# Altium project HEXCORE.PrjPcb
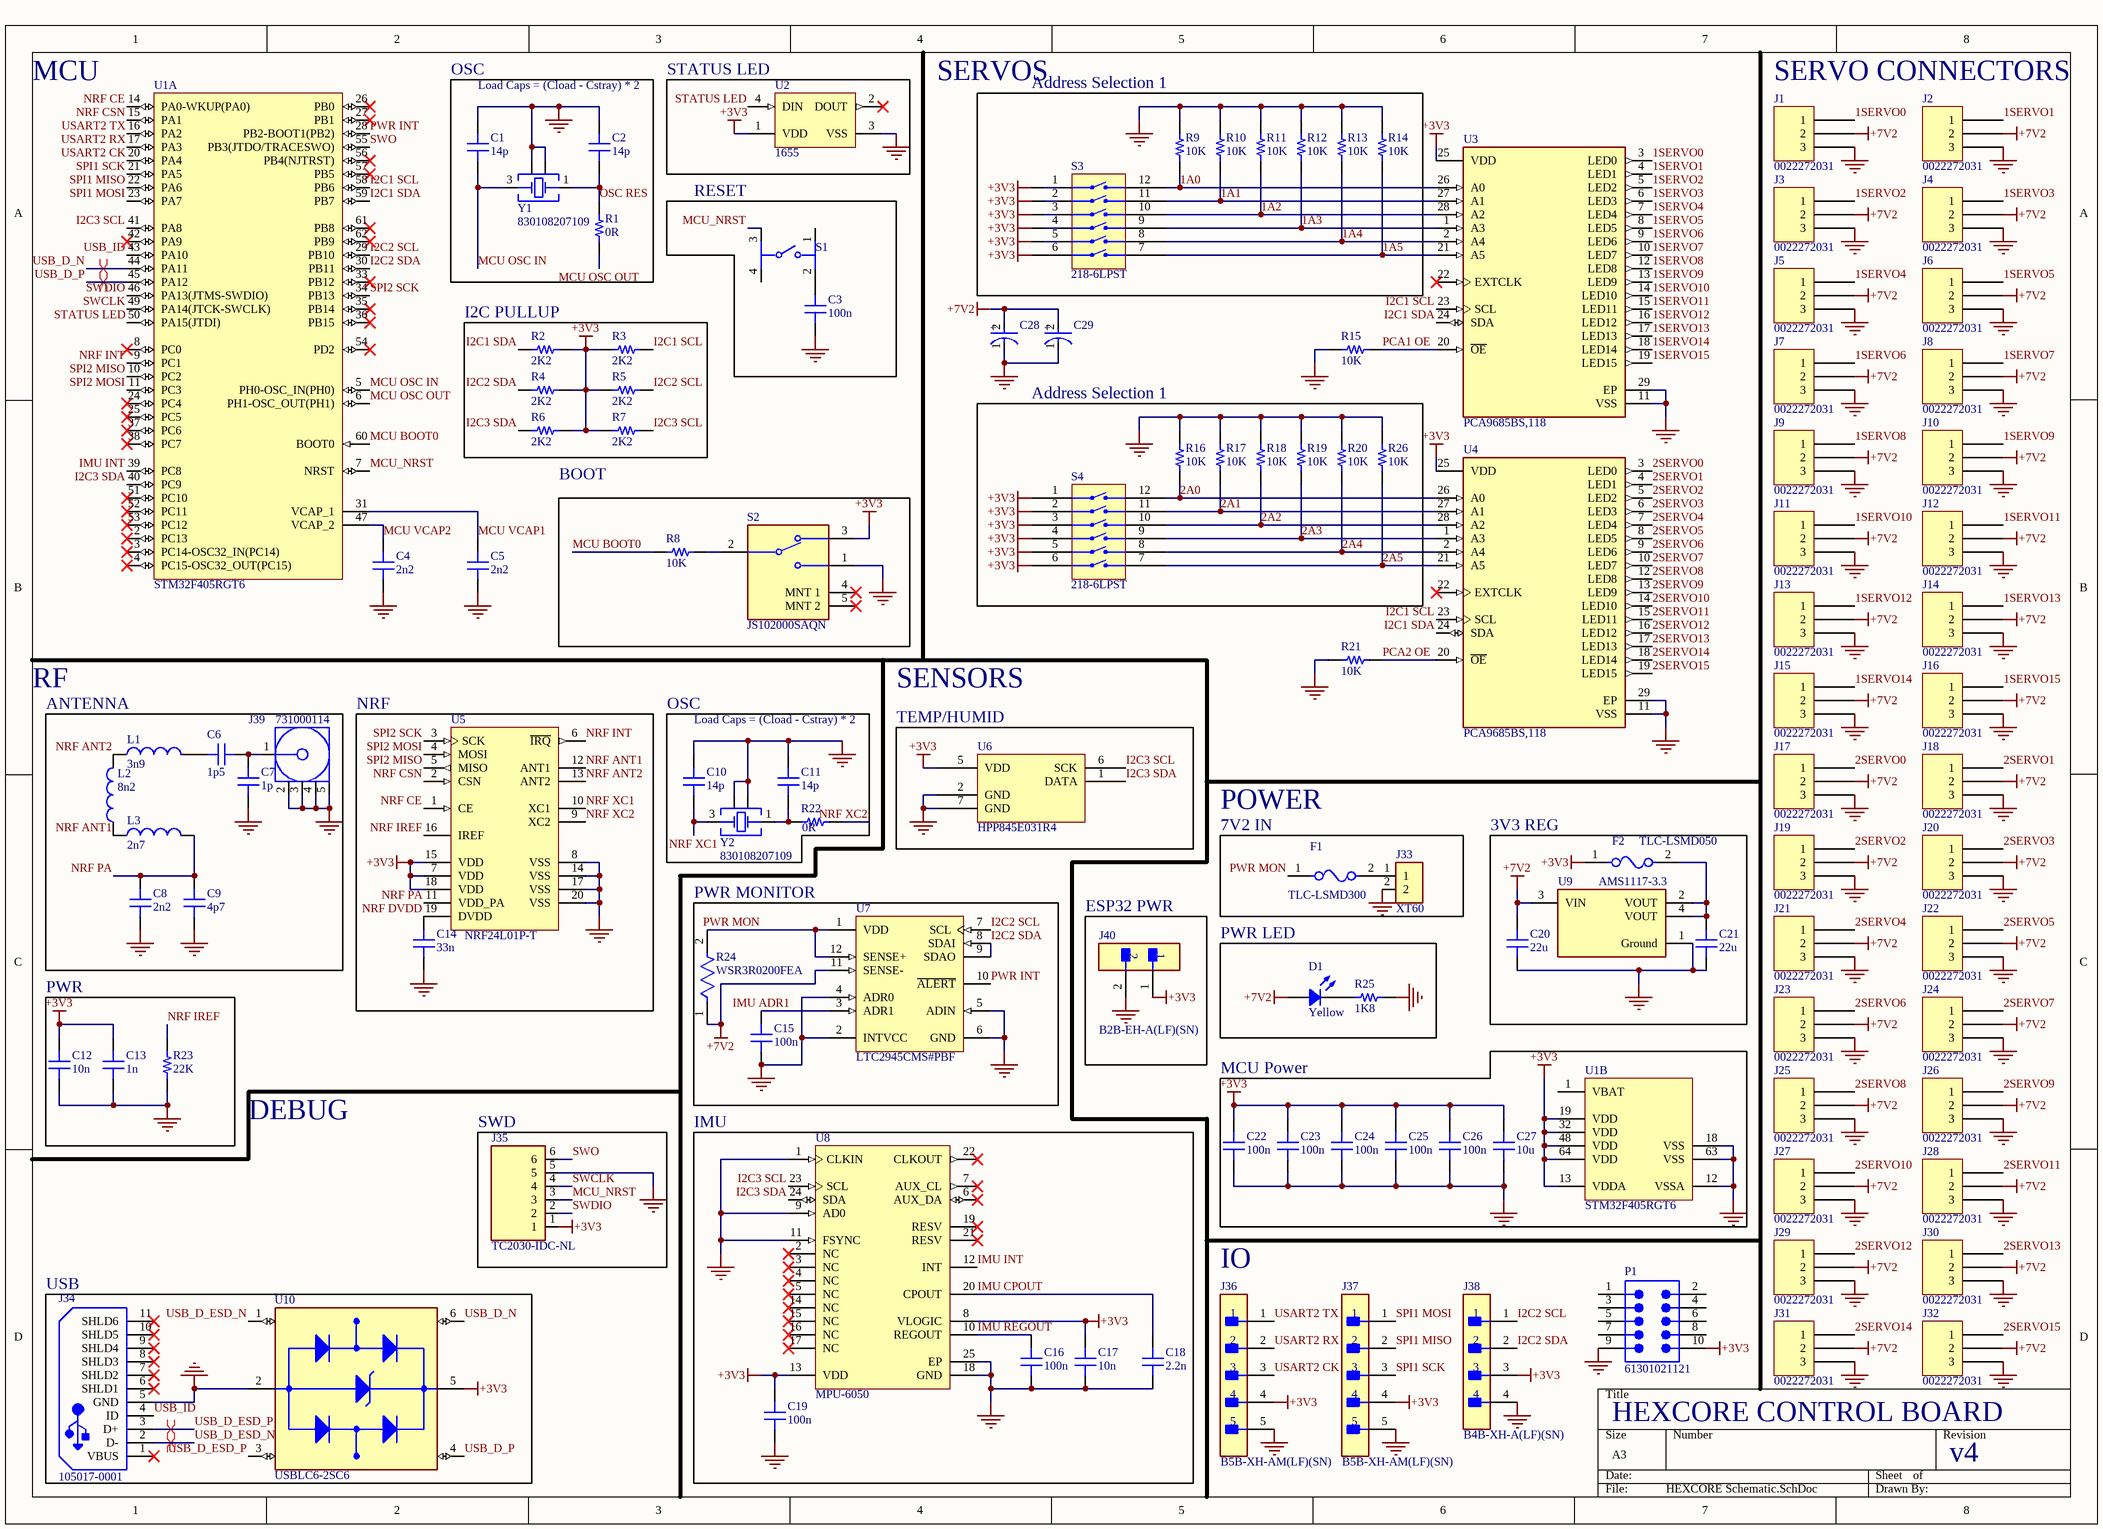
[diagram p0: HEXCORE Schematic.SchDoc]
1 sheet, 118 parts. Net scope: global (net labels, ports and power ports of the same name join across sheets).
Board file: HEXCORE PCB.PcbDoc

## Sheet HEXCORE Schematic.SchDoc
size A3; SheetNumber: 1; SheetTotal: 1

### Parts
C1  14p  [CAP 0402_1005]
C2  14p  [CAP 0402_1005]
C3  100n  [CAP 0402_1005]
C4  2n2  [CAP 0402_1005]
C5  2n2  [CAP 0402_1005]
C6  1p5  [CAP 0402_1005]
C7  1p  [CAP 0402_1005]
C8  2n2  [CAP 0402_1005]
C9  4p7  [CAP 0402_1005]
C10  14p  [CAP 0402_1005]
C11  14p  [CAP 0402_1005]
C12  10n  [CAP 0402_1005]
C13  1n  [CAP 0402_1005]
C14  33n  [CAP 0402_1005]
C15  100n  [CAP 0402_1005]
C16  100n  [CAP 0402_1005]
C17  10n  [CAP 0402_1005]
C18  2.2n  [CAP 0402_1005]
C19  100n  [CAP 0402_1005]
C20  22u  [CAP 0603_1608]
C21  22u  [CAP 0603_1608]
C22  100n  [CAP 0402_1005]
C23  100n  [CAP 0402_1005]
C24  100n  [CAP 0402_1005]
C25  100n  [CAP 0402_1005]
C26  100n  [CAP 0402_1005]
C27  10u  [CAP 0603_1608]
C28  EEE-1AA102P  [FP-SG-MFG]  (value not drawn)
C29  EEE-1AA102P  [FP-SG-MFG]  (value not drawn)
D1  Yellow  [LED 1206_3216 YELLOW]
F1  TLC-LSMD300  [FP-2920L-MFG]
F2  TLC-LSMD050  [FP-2920L-MFG]
J1  0022272031  [MOLEX KK 0022272031]
J2  0022272031  [MOLEX KK 0022272031]
J3  0022272031  [MOLEX KK 0022272031]
J4  0022272031  [MOLEX KK 0022272031]
J5  0022272031  [MOLEX KK 0022272031]
J6  0022272031  [MOLEX KK 0022272031]
J7  0022272031  [MOLEX KK 0022272031]
J8  0022272031  [MOLEX KK 0022272031]
J9  0022272031  [MOLEX KK 0022272031]
J10  0022272031  [MOLEX KK 0022272031]
J11  0022272031  [MOLEX KK 0022272031]
J12  0022272031  [MOLEX KK 0022272031]
J13  0022272031  [MOLEX KK 0022272031]
J14  0022272031  [MOLEX KK 0022272031]
J15  0022272031  [MOLEX KK 0022272031]
J16  0022272031  [MOLEX KK 0022272031]
J17  0022272031  [MOLEX KK 0022272031]
J18  0022272031  [MOLEX KK 0022272031]
J19  0022272031  [MOLEX KK 0022272031]
J20  0022272031  [MOLEX KK 0022272031]
J21  0022272031  [MOLEX KK 0022272031]
J22  0022272031  [MOLEX KK 0022272031]
J23  0022272031  [MOLEX KK 0022272031]
J24  0022272031  [MOLEX KK 0022272031]
J25  0022272031  [MOLEX KK 0022272031]
J26  0022272031  [MOLEX KK 0022272031]
J27  0022272031  [MOLEX KK 0022272031]
J28  0022272031  [MOLEX KK 0022272031]
J29  0022272031  [MOLEX KK 0022272031]
J30  0022272031  [MOLEX KK 0022272031]
J31  0022272031  [MOLEX KK 0022272031]
J32  0022272031  [MOLEX KK 0022272031]
J33  XT60  [AMASS_XT60PB-M]
J34  105017-0001  [USB-MICRO-B_V]
J35  TC2030-IDC-NL  [TAG_TC2030-IDC-NL]
J36  B5B-XH-AM(LF)(SN)  [FP-B5B-XH-AM_LF_SN-MFG]
J37  B5B-XH-AM(LF)(SN)  [FP-B5B-XH-AM_LF_SN-MFG]
J38  B4B-XH-A(LF)(SN)  [FP-B4B-XH-A_LF_SN-MFG]
J39  731000114  [MOLX-731000114_V]
J40  B2B-EH-A(LF)(SN)  [FP-B2B-EH-A_LF_SN-MFG]
L1  3n9  [WE-TCI_0402]
L2  8n2  [WE-TCI_0402]
L3  2n7  [WE-TCI_0402]
P1  61301021121  [61301021121]
R1  0R  [RES 0402_1005]
R2  2K2  [RES 0402_1005]
R3  2K2  [RES 0402_1005]
R4  2K2  [RES 0402_1005]
R5  2K2  [RES 0402_1005]
R6  2K2  [RES 0402_1005]
R7  2K2  [RES 0402_1005]
R8  10K  [RES 0402_1005]
R9  10K  [RES 0402_1005]
R10  10K  [RES 0402_1005]
R11  10K  [RES 0402_1005]
R12  10K  [RES 0402_1005]
R13  10K  [RES 0402_1005]
R14  10K  [RES 0402_1005]
R15  10K  [RES 0402_1005]
R16  10K  [RES 0402_1005]
R17  10K  [RES 0402_1005]
R18  10K  [RES 0402_1005]
R19  10K  [RES 0402_1005]
R20  10K  [RES 0402_1005]
R21  10K  [RES 0402_1005]
R22  0R  [RES 0402_1005]
R23  22K  [RES 0402_1005]
R24  WSR3R0200FEA  [FP-WSR3-MFG]
R25  1K8  [RES 0603_1608]
R26  10K  [RES 0402_1005]
S1  PTS645SM43SMTR92LFS  [FP-PTS645SM43SMTR92LFS-MFG]  (value not drawn)
S2  JS102000SAQN  [FP-JS102000SAQN-MFG]
S3  218-6LPST  [CTS 218-6LPJ]
S4  218-6LPST  [CTS 218-6LPJ]
U1  STM32F405RGT6  [STM-LQFP64_N]  (parts A,B of 2)
U2  1655  [ADA-RGB-1655_V]
U3  PCA9685BS,118  [FP-SOT788-1-IPC_B]
U4  PCA9685BS,118  [FP-SOT788-1-IPC_B]
U5  NRF24L01P-T  [NRSC-QFN-20_L]
U6  HPP845E031R4  [TE HPP845E031R4]
U7  LTC2945CMS#PBF  [LT-MS-12_M]
U8  MPU-6050  [IS-QFN-24_V]
U9  AMS1117-3.3  [FP-AMS1117-IPC_C]
U10  USBLC6-2SC6  [SOT95P280X145-6N]
Y1  830108207109  [WE-XTAL_CFPX-180]
Y2  830108207109  [WE-XTAL_CFPX-180]

### Blocks framed on the sheet
OSC: C1 C2 R1 Y1
STATUS LED: U2
Address Selection 1: R9-R14 S3
RESET: C3 S1
I2C PULLUP: R2-R7
Address Selection 1: R16-R20 R26 S4
BOOT: R8 S2
ANTENNA: C6-C9 J39 L1-L3
NRF: C14 U5
OSC: C10 C11 R22 Y2
TEMP/HUMID: U6
7V2 IN: F1 J33
3V3 REG: C20 C21 F2 U9
PWR MONITOR: C15 R24 U7
ESP32 PWR: J40
PWR LED: D1 R25
PWR: C12 C13 R23
SWD: J35
IMU: C16-C19 U8
USB: J34 U10

### Nets
+3V3: C12.2 C13.2 C17.2 C19.2 C22.2 C23.2 C24.2 C25.2 C26.2 C27.2 F2.1 J35.1 J36.4 J37.4 J38.3 J40.1 P1.10 R2.1 R3.2 R4.1 R5.2 R6.1 R7.2 S2.3 S3.1(GND) S3.2(GND) S3.3(GND) S3.4(GND) S3.5 S3.6 S4.1(GND) S4.2(GND) S4.3(GND) S4.4(GND) S4.5 S4.6 U1.13(VDDA) U1.19(VDD) U1.32(VDD) U1.48(VDD) U1.64(VDD) U2.1(VDD) U3.25(VDD) U4.25(VDD) U5.7(VDD) U5.15(VDD) U5.18(VDD) U6.5(VDD) U8.8(VLOGIC) U8.13(VDD) U10.5(VBUS)
+7V2: C20.2 C28.2(A) C29.2(A) D1.1 J1.2 J2.2 J3.2 J4.2 J5.2 J6.2 J7.2 J8.2 J9.2 J10.2 J11.2 J12.2 J13.2 J14.2 J15.2 J16.2 J17.2 J18.2 J19.2 J20.2 J21.2 J22.2 J23.2 J24.2 J25.2 J26.2 J27.2 J28.2 J29.2 J30.2 J31.2 J32.2 R24.1 U7.11(SENSE-) U9.3(VIN)
GND: C1.2 C2.2 C3.2 C4.1 C5.1 C7.1 C8.1 C9.1 C10.2 C11.2 C12.1 C13.1 C14.1 C15.1 C16.1 C17.1 C18.1 C19.1 C20.1 C21.1 C22.1 C23.1 C24.1 C25.1 C26.1 C27.1 C28.1(C) C29.1(C) J1.3 J2.3 J3.3 J4.3 J5.3 J6.3 J7.3 J8.3 J9.3 J10.3 J11.3 J12.3 J13.3 J14.3 J15.3 J16.3 J17.3 J18.3 J19.3 J20.3 J21.3 J22.3 J23.3 J24.3 J25.3 J26.3 J27.3 J28.3 J29.3 J30.3 J31.3 J32.3 J33.2 J34.5(GND) J35.5 J36.5 J37.5 J38.4 J39.2 J39.3 J39.4 J39.5 J40.2 P1.9 R9.2 R10.2 R11.2 R12.2 R13.2 R14.2 R15.2 R16.2 R17.2 R18.2 R19.2 R20.2 R21.2 R23.2 R25.2 R26.2 S2.1 U1.12(VSSA) U1.18(VSS) U1.63(VSS) U2.3(VSS) U3.11(VSS) U3.29(EP) U4.11(VSS) U4.29(EP) U5.8(VSS) U5.14(VSS) U5.17(VSS) U5.20(VSS) U6.2(GND) U6.7(GND) U7.2(INTVCC) U7.4(ADR0) U7.5(ADIN) U7.6(GND) U8.1(CLKIN) U8.9(AD0) U8.11(FSYNC) U8.18(GND) U8.25(EP) U9.1(Ground) U10.2(GND) Y1.2(GND&Lid) Y1.4(GND&Lid) Y2.2(GND&Lid) Y2.4(GND&Lid)
1A0: R9.1 S3.12 U3.26(A0)
1A1: R10.1 S3.11 U3.27(A1)
1A2: R11.1 S3.10 U3.28(A2)
1A3: R12.1 S3.9 U3.1(A3)
1A4: R13.1 S3.8 U3.2(A4)
1A5: R14.1 S3.7 U3.21(A5)
1SERVO0: J1.1 U3.3(LED0)
1SERVO1: J2.1 U3.4(LED1)
1SERVO2: J3.1 U3.5(LED2)
1SERVO3: J4.1 U3.6(LED3)
1SERVO4: J5.1 U3.7(LED4)
1SERVO5: J6.1 U3.8(LED5)
1SERVO6: J7.1 U3.9(LED6)
1SERVO7: J8.1 U3.10(LED7)
1SERVO8: J9.1 U3.12(LED8)
1SERVO9: J10.1 U3.13(LED9)
1SERVO10: J11.1 U3.14(LED10)
1SERVO11: J12.1 U3.15(LED11)
1SERVO12: J13.1 U3.16(LED12)
1SERVO13: J14.1 U3.17(LED13)
1SERVO14: J15.1 U3.18(LED14)
1SERVO15: J16.1 U3.19(LED15)
2A0: R16.1 S4.12 U4.26(A0)
2A1: R17.1 S4.11 U4.27(A1)
2A2: R18.1 S4.10 U4.28(A2)
2A3: R19.1 S4.9 U4.1(A3)
2A4: R20.1 S4.8 U4.2(A4)
2A5: R26.1 S4.7 U4.21(A5)
2SERVO0: J17.1 U4.3(LED0)
2SERVO1: J18.1 U4.4(LED1)
2SERVO2: J19.1 U4.5(LED2)
2SERVO3: J20.1 U4.6(LED3)
2SERVO4: J21.1 U4.7(LED4)
2SERVO5: J22.1 U4.8(LED5)
2SERVO6: J23.1 U4.9(LED6)
2SERVO7: J24.1 U4.10(LED7)
2SERVO8: J25.1 U4.12(LED8)
2SERVO9: J26.1 U4.13(LED9)
2SERVO10: J27.1 U4.14(LED10)
2SERVO11: J28.1 U4.15(LED11)
2SERVO12: J29.1 U4.16(LED12)
2SERVO13: J30.1 U4.17(LED13)
2SERVO14: J31.1 U4.18(LED14)
2SERVO15: J32.1 U4.19(LED15)
I2C1 SCL: R3.1 U1.58(PB6) U3.23(SCL) U4.23(SCL)
I2C1 SDA: R2.2 U1.59(PB7) U3.24(SDA) U4.24(SDA)
I2C2 SCL: J38.1 R5.1 U1.29(PB10) U7.7(SCL)
I2C2 SDA: J38.2 R4.2 U1.30(PB11) U7.8(SDAI) U7.9(SDAO)
I2C3 SCL: R7.1 U1.41(PA8) U6.6(SCK) U8.23(SCL)
I2C3 SDA: R6.2 U1.40(PC9) U6.1(DATA) U8.24(SDA)
IMU ADR1: C15.2 U7.3(ADR1)
IMU CPOUT: C18.2 U8.20(CPOUT)
IMU INT: U1.39(PC8) U8.12(INT)
IMU REGOUT: C16.2 U8.10(REGOUT)
MCU BOOT0: R8.1 U1.60(BOOT0)
MCU OSC IN: C1.1 U1.5(PH0-OSC_IN(PH0)) Y1.3(Crystal)
MCU OSC OUT: R1.1 U1.6(PH1-OSC_OUT(PH1))
MCU VCAP1: C5.2 U1.31(VCAP_1)
MCU VCAP2: C4.2 U1.47(VCAP_2)
MCU_NRST: J35.3 S1.3 U1.7(NRST)
NRF ANT1: L2.1 L3.1 U5.12(ANT1)
NRF ANT2: L1.1 L2.2 U5.13(ANT2)
NRF CE: U1.14(PA0-WKUP(PA0)) U5.1(CE)
NRF CSN: U1.15(PA1) U5.2(CSN)
NRF DVDD: C14.2 U5.19(DVDD)
NRF INT: U1.9(PC1) U5.6(~{IRQ})
NRF IREF: R23.1 U5.16(IREF)
NRF PA: C8.2 C9.2 L3.2 U5.11(VDD_PA)
NRF XC1: C10.1 U5.10(XC1) Y2.3(Crystal)
NRF XC2: R22.2 U5.9(XC2)
OSC RES: C2.1 R1.2 Y1.1(Crystal)
PCA1 OE: R15.1 U3.20(~{OE})
PCA2 OE: R21.1 U4.20(~{OE})
PWR INT: U1.28(PB2-BOOT1(PB2)) U7.10(~{ALERT})
PWR MON: F1.1 R24.2 U7.1(VDD) U7.12(SENSE+)
SPI1 MISO: J37.2 U1.22(PA6)
SPI1 MOSI: J37.1 U1.23(PA7)
SPI1 SCK: J37.3 U1.21(PA5)
SPI2 MISO: U1.10(PC2) U5.5(MISO)
SPI2 MOSI: U1.11(PC3) U5.4(MOSI)
SPI2 SCK: U1.34(PB13) U5.3(SCK)
STATUS LED: U1.50(PA15(JTDI)) U2.4(DIN)
SWCLK: J35.4 U1.49(PA14(JTCK-SWCLK))
SWDIO: J35.2 U1.46(PA13(JTMS-SWDIO))
SWO: J35.6 U1.55(PB3(JTDO/TRACESWO))
USART2 CK: J36.3 U1.20(PA4)
USART2 RX: J36.2 U1.17(PA3)
USART2 TX: J36.1 U1.16(PA2)
USB_D_ESD_N: J34.2(D-) U10.1(I/O1_IN)
USB_D_ESD_P: J34.3(D+) U10.3(I/O2_IN)
USB_D_N: U1.44(PA11) U10.6(I/O1_OUT)
USB_D_P: U1.45(PA12) U10.4(I/O2_OUT)
USB_ID: J34.4(ID) U1.43(PA10)
NetC3_1: C3.1 S1.2
NetC6_1: C6.1 C7.2 J39.1
NetC6_2: C6.2 L1.2
NetC11_1: C11.1 R22.1 Y2.1(Crystal)
NetC21_2: C21.2 F2.2 U9.2(VOUT) U9.4(VOUT)
NetD1_2: D1.2 R25.1
NetF1_2: F1.2 J33.1
NetR8_2: R8.2 S2.2(C)

Not connected (* = marked no-connect by the designer): J34 1(VBUS)* 6(SHLD1)* 7(SHLD2)* 8(SHLD3)* 9(SHLD4)* 10(SHLD5)* 11(SHLD6)*; P1 1 2 3 4 5 6 7 8; S1 1 4; S2 4(MNT_1)* 5(MNT_2)*; U1 1(VBAT) 2(PC13)* 3(PC14-OSC32_IN(PC14))* 4(PC15-OSC32_OUT(PC15))* 8(PC0)* 24(PC4)* 25(PC5)* 26(PB0)* 27(PB1)* 33(PB12)* 35(PB14)* 36(PB15)* 37(PC6)* 38(PC7)* 42(PA9)* 51(PC10)* 52(PC11)* 53(PC12)* 54(PD2)* 56(PB4(NJTRST))* 57(PB5)* 61(PB8)* 62(PB9)*; U2 2(DOUT)*; U3 22(EXTCLK)*; U4 22(EXTCLK)*; U8 2(NC)* 3(NC)* 4(NC)* 5(NC)* 6(AUX_DA)* 7(AUX_CL)* 14(NC)* 15(NC)* 16(NC)* 17(NC)* 19(RESV)* 21(RESV)* 22(CLKOUT)*

### Layout directives
differential pair: USB_D_ESD_N, USB_D_ESD_P, USB_D_N, USB_D_P

### Notes on the sheet
- MCU
- SERVOS
- SERVO CONNECTORS
- Load Caps = (Cload - Cstray) * 2
- RF
- SENSORS
- POWER
- MCU Power
- DEBUG
- (near J36) IO
- HEXCORE CONTROL BOARD
- v4
- (in symbol CMP-00287-55501125-1) +

### Library data of the parts
C1 C2 C10 C11 = GJM1555C1H140GB01D: CAP CER 14PF 50V C0G/NP0 0402; Part Number: GJM1555C1H140GB01D
C3 C15 C16 C19 = CL05B104KP5VPNC: CAP CER 100NF 10V X7R 0402; Part Number: CL05B104KP5VPNC
C4 C5 C18 C22-C26 = C0402C222J3GEC7867: CAP CER 0402 2.2NF 25V C0G 5%; Part Number: C0402C222J3GEC7867
C6-C9 C12 C13 = C0402C103K4REC7867: CAP CER 0402 10NF 16V X7R 10%; manufacturer: KEMET; Capacitance: 10000 pF; Part Number: C0402C103K4REC7867; Applications: ESD Protection; componentlink1description: Datasheet; componentlink1url: https://connect.kemet.com:7667/gateway/IntelliData-ComponentDocumentation/1.0/download/datasheet/C0402C103K4REC7867; componentlink2description: DigiKey Link; componentlink2url: https://www.digikey.com/en/products/detail/kemet/C0402C103K4REC7867/8643577; Device Package: 0402 (1005 Metric); lastupdated: 23/01/2024 8:03:47 PM; Lifecycle Status: Active; Minimum Order: 1; Mounting Type: Surface Mount, MLCC; Operating Temperature: -55°C ~ 125°C; Package / Case: 0402 (1005 Metric); packaging: TapeAndReel; partid: 52124; Part Status: Active; price: 0.01; series: ESD SMD Comm X7R; Size / Dimension: 0.039" L x 0.020" W (1.00mm x 0.50mm); Supplier 1: DigiKey; Supplier Part Number 1: 399-C0402C103K4REC7867CT-ND; Temperature Coefficient: X7R; Thickness (Max): 0.022" (0.55mm); Tolerance: ±10%; Voltage - Rated: 16V
  C6: Value: 1p5
  C7: Value: 1p
  C8: Value: 2n2
  C9: Value: 4p7
  C12: Value: 10n
  C13: Value: 1n
C14 = C0402C330J4RACAUTO: CAP CER 33PF 16V X7R 0402; manufacturer: KEMET; Tolerance: ±5%; Part Number: C0402C330J4RACAUTO; Value: 33n; Applications: Automotive, Bypass, Decoupling; Capacitance: 33 pF; componentlink1description: Datasheet; componentlink1url: https://api.kemet.com/component-edge/download/datasheet/C0402C330J4RACAUTO.pdf; componentlink2description: DigiKey Link; componentlink2url: https://www.digikey.com/en/products/detail/kemet/C0402C330J4RACAUTO/6219618; Device Package: 0402 (1005 Metric); lastupdated: 23/01/2024 8:04:40 PM; Lifecycle Status: Active; Minimum Order: 1; Mounting Type: Surface Mount, MLCC; Operating Temperature: -55°C ~ 125°C; Package / Case: 0402 (1005 Metric); packaging: TapeAndReel; partid: 1721; Part Status: Active; price: 0.01; Ratings: AEC-Q200; series: SMD Auto X7R; Size / Dimension: 0.039" L x 0.020" W (1.00mm x 0.50mm); Supplier 1: DigiKey; Supplier Part Number 1: 399-13708-1-ND; Temperature Coefficient: X7R; Thickness (Max): 0.022" (0.55mm); Voltage - Rated: 16V
C17 = C0402C103J5RECAUTO: CAP CER 0402 10NF 50V X7R 5%; Part Number: C0402C103J5RECAUTO
C20 C21 = CL10A226MPCNUBE: CAP CER 22UF 10V X5R 0603; Part Number: CL10A226MPCNUBE
C27 = GRM188R60J106ME47D: CAP CER 10UF 6.3V X5R 0603; Part Number: GRM188R60J106ME47D
C28 C29 = CMP-00287-55501125-1: EEE-1AA102P Aluminum Electrolytic Capacitor, 1000 uF, 10 V, ± 20%, 2000 hours @ 85°C, Radial Can - SMD; Leakage Current: 3µA; Ripple Current (AC): 580mA; Capacitance: 1mF; Voltage: 10V; NexarPartId: 55501125; REACH SVHC: Unknown; Length: 10.5mm; Case/Package: Radial; Height - Seated (Max): 10.2108mm; Min Operating Temperature: -40°C; Packaging: Cut Tape; Contact Plating: Tin; Height: 10.2mm; Schedule B: 8532220020, 8532220020; RoHS: Compliant; Radiation Hardening: No; Mount: PCB, Surface Mount; Max Operating Temperature: 85°C; Voltage Rating (DC): 10V; Life (Hours): 2000hours; Voltage Rating: 10V; Ripple Current: 580mA; Lifecycle Status: Production; Termination: SMD/SMT; Lead Free: Lead Free; Diameter: 10mm; Tolerance: 20%
D1 = 5990240007F: LED YELLOW 1206 SMD; Manufacturer: Dialight; Configuration: Standard; Current - Test: 20mA; Lens Color: 0.80mm; Lens Size: 2.00mm x 1.60mm; Lens Style: Rectangle with Flat Top; Millicandela Rating: 126mcd; Viewing Angle: 140°; Voltage - Forward (Vf) (Typ): 2.1V; Wavelength - Dominant: 590nm; Part Number: 5990240007F; Color: Yellow; ComponentLink1Description: Datasheet; ComponentLink1URL: http://www.dialightsignalsandcomponents.com/Assets/Brochures_And_Catalogs/Indication/CBI_SMD_new/Dialight_CBI_data_599-1206_Apr2018.pdf; ComponentLink2Description: DigiKey Link; ComponentLink2URL: https://www.digikey.com/en/products/detail/dialight/5990240007F/9385418; Device Package: 1206 (3216 Metric); Height (Max): 0.80mm; LastUpdated: 27/01/2024 9:27:52 PM; Lifecycle Status: Active; Minimum Order: 1; Mounting Type: Surface Mount; Package / Case: 1206 (3216 Metric); Packaging: TapeAndReel; PartId: 1; Part Status: Active; Price: 0.04; Series: 599; Size / Dimension: 3.20mm L x 1.60mm W; Supplier 1: DigiKey; Supplier Part Number 1: 350-4363-1-ND; Supplier Device Package: 1206; Value: Yellow
F1 F2 = CMP-2000-05550-2: PTC RESET FUSE 15V 3A 2920; Manufacturer: Littelfuse; Manufacturer Part Number: 2920L300/15DR; Current Rating: 40A; Trip Current: 5A; Trip Time: 20s; Resistance: 0.015-0.048Ω; Value: 0.015-0.048Ω; Device Class L3: unset; Temperature: -40°C to +85°C; ComponentLink2Description: Datasheet; Temperature Range High: +85°C; Digikey Description: PTC RESET FUSE 15V 3A 2920; Lead Free: Yes; Height: 1.25mm; Voltage Rating: 15V; Package: 2920L; Temperature Range Low: -40°C; Ambient Temperature Range High: +85°C; RoHS: TRUE; Ambient Temperature Range Low: -40°C; Device Class L2: PTC Resettable Fuses; Category: Fuse; Automotive: No; ComponentLink2URL: https://m.littelfuse.com/~/media/electronics/datasheets/resettable_ptcs/littelfuse_ptc_2920l_datasheet.pdf.pdf; Device Class L1: Circuit Protection; Hold Current: 3A; Octopart: https://octopart.com/2920l300%2F15dr-littelfuse-673797
J1-J32 = 0022272031: CONN HEADER VERT 3POS 2.54MM; Part Number: 0022272031
J33 = XT60_YELLOW: Power connector; 65A; PIN: 2; Colour: yellow; MP: XT60 YELLOW; MF: Pololu; SnapEDA_Link: https://www.snapeda.com/parts/XT60%20YELLOW/Pololu/view-part/?ref=snap; Availability: Not in stock; Package: None; Check_prices: https://www.snapeda.com/parts/XT60%20YELLOW/Pololu/view-part/?ref=eda; Value: *; Price: None
J34 = CMP-2000-05827-1: Micro-USB B Receptacle, Right Angle, Bottom Mount, Surface Mount, with Solder Tabs, -30 to 85 degC, 5-Pin USB, RoHS, Tape and Reel; Manufacturer: Molex; Featured Product: Micro-USBConnectorsUSBConnectors; Other Names: WM1399DKR; Package Version: Rev. F, 12/2012; Number of Contacts: 5; Connector Type: USB-microB; Catalog Drawings: 1050170001; 3D Model: 105017-0001.stp; Mating Products: WM17145-ND-CABLEMICROUSBBTOSTDA1.0MWM17147-ND-CABLEMICROUSBBTOSTDA2.0MWM17146-ND-CABLEMICROUSBBTOSTDA1.5M; PCN Assembly/Origin: ResinSupplier21/Oct/2015; Voltage - Max: 30V; Online Catalog: Molex-MicroUSB; Manufacturer URL: http://www.molex.com/; Package Description: 5-Leads USB, Micro B, Body 7.5 x 5 mm, Pitch 0.65 mm; Datasheet URL: http://www.molex.com/elqNow/elqRedir.htm?ref=http://www.molex.com/webdocs/datasheets/pdf/en-us/1050170001_IO_CONNECTORS.pdf; Ingress Protection: -; Datasheet Version: 03/2016; Mounting Type: BoardCutout,SurfaceMount,RightAngle; Circuits: 5; Standard Package: 1; Package Reference: MICRO-B; Package URL: http://www.molex.com/pdm_docs/sd/1050170001_sd.pdf; Category: Connectors,Interconnects; Series: -; RoHS Information: 1050170001CertofCompliance; Features: Shielded,SolderRetention; Family: USB,DVI,HDMIConnectors; Specifications: -; Gender: Receptacle; Packaging: Digi-Reel®; Mounting Technology: SurfaceMount
J35 = TC2030-IDC-NL: CABLE ADAPTER 6 POS; Value: *; MP: TC2030-IDC-NL; Availability: Unavailable; Package: None; Price: None
J36 J37 = CMP-17439-000304-1: CONN HEADER VERT 5POS 2.5MM; Mated Stacking Heights: 9.8mm; Voltage Rating: 250V; Max Current Rating: 3A; Number of Positions: 5; Contact Resistance: 20mR; Depth: 5.75mm; Connector Type: Header; Color: Green; Insulation Material: Nylon; Contact Plating: Copper; Length: 14.9mm; Fastening Type: Detent; Contact Material: Brass; Number of Rows: 1; Contact Type: Male Pin; Housing Material: Polyamide; Housing Color: White; Lead Free: Lead Free; Max Voltage Rating (AC): 250V; Mount: Through Hole; Contact Shape: Square; Min Operating Temperature: -25°C; Packaging: Bulk; Orientation: Straight; Insulation Color: Natural; Series: XH; Flammability Rating: UL94 V-0; Contact Finish - Mating: TIN; Max Operating Temperature: 85°C; Termination: Solder; Pitch: 2.5mm
J38 = CMP-17439-000250-1: CONN HEADER VERT 4POS 2.5MM; Number of Contacts: 4; Contact Resistance: 20mR; Voltage Rating: 250V; Max Current Rating: 3A; Gender: Male; Wire/Cable Gauge: 22AWG; Mated Stacking Heights: 9.8mm; Insulation Resistance: 1GR; Orientation: Straight; Contact Type: Male Pin; Contact Finish - Mating: TIN; Series: XH; Max Voltage Rating (AC): 250V; Lead Pitch: 2.5mm; Contact Shape: Square; Insulation Color: Natural; Termination: Solder; Lead Free: Lead Free; Voltage Rating (AC): 250V; Number of Rows: 1; Flammability Rating: UL94 V-0; Number of Positions: 4; Max Operating Temperature: 85°C; Package Quantity: 500; Mount: Through Hole; REACH SVHC: No SVHC; Connector Type: Header; Insulation Material: Nylon; Fastening Type: Detent; Min Operating Temperature: -25°C; Housing Color: White; Packaging: Bulk; Contact Plating: Tin; Contact Material: Brass; Max Voltage Rating (DC): 250V; Housing Material: Polyamide; Color: Natural; Material: Polyamide; Pitch: 2.5mm; Depth: 5.75mm; Current Rating: 3A; Length: 12.4mm
J39 = CMP-2000-05487-1: SMA Right-Angle PCB Jack Receptacle, Brass Body, Gold Plated, 50 Ohm, 5-Pin THD, RoHS, Tray; Manufacturer: Molex; Datasheet Version: 09/2016; Package Description: 5-Pin Through Hole Device, Body 14.8 x 6.35 mm, Pitch 2.54 mm; Datasheet URL: http://www.molex.com/webdocs/datasheets/pdf/en-us/0731000114_RF_COAX_CONNECTORS.pdf; Manufacturer URL: http://www.molex.com/; Package Reference: 731000114; Mounting Technology: ThroughHole; Package URL: http://www.molex.com/pdm_docs/sd/731000114_sd.pdf
J40 = CMP-17439-000026-1: CONN HEADER VERT 2POS 2.5MM; Number of Contacts: 2; Current Rating: 3A; Connector Type: Plug; Contact Resistance: 20mR; Gender: Male; Voltage Rating: 250V; Fastening Type: Detent; Depth: 3.8mm; Max Operating Temperature: 85°C; Orientation: Straight; Series: EH; Contact Plating: Tin; Min Operating Temperature: -25°C; Contact Type: Male Pin; Housing Color: White; Termination: Press-Fit; Housing Material: Nylon; Pitch: 2.5mm; Number of Positions: 2; Max Current Rating: 3A; Packaging: Bulk; Lead Free: Lead Free; Number of Rows: 1; Length: 7.5mm; Contact Mating Length: 0.13inch; Color: Natural; Max Voltage Rating (AC): 250V; Contact Material: Copper Alloy; Mount: Through Hole
L1-L3 = CMP-03913-14415878-1: 744901039 Fixed Ind 3.9NH 340MA 500MOHM Sm; Self Resonant Frequency: 6GHz; Q Factor: 13; Core Material: Alumina; Test Frequency: 500MHz; DC Resistance (DCR): 370mΩ; Shielding: Unshielded; Inductance: 3.9nH; Case Code (Imperial): 0402; Termination: SMD/SMT; NexarPartId: 14415878; RoHS: Compliant; Packaging: Digi-Reel®; Min Operating Temperature: -40°C; Composition: Thin Film; Case Code (Metric): 1005; Current Rating: 340mA; Weight: 652.039032µg; Max DC Current: 340mA; Length: 1mm; Width: 500µm; REACH SVHC: Unknown; Case/Package: 0402; Height - Seated (Max): 406.4µm; Number of Pins: 2; Height: 320µm; Mount: Surface Mount; Max Operating Temperature: 125°C
P1 = CMP-1502-01084-2: NexarPartId: 18818163; Current Rating: 3A; Voltage Rating: 250V; Row Spacing: 2.54mm; Insulation: Insulated; Insulation Resistance: 1GΩ; Contact Resistance: 20mΩ; Gender: Male; Connector Type: Male Pin; Number of Positions: 10; Number of Pins: 10; Termination: Through Hole; Contact Material: Copper; Lead Pitch: 2.54mm; RoHS: Compliant; Max Operating Temperature: 105°C; Flammability Rating: UL94 V-0; Contact Mating Length: 5.9944mm; Packaging: Bulk; Min Operating Temperature: -40°C; Height: 2.54mm; Contact Gender: Male; Length: 12.7mm; Housing Material: PBT; Operating Supply Voltage: 250V; Color: Black; Number of Rows: 2; Contact Plating: Gold; REACH SVHC: Unknown; Width: 12.7mm; Pitch: 2.54mm; Mount: Through Hole; Orientation: Vertical; Number of Contacts: 10
R1 R22 = 5112: 0402 JUMPER ON TAPE AND REEL; Part Number: 5112
R2-R8 = RP73PF1E10KBTD: RES 10K OHM 0.1% 1/10W 0402; Part Number: RP73PF1E10KBTD
R9-R21 R26 = CPF0402B10KE: RES SMD 10K OHM 0.1% 1/16W 0402; Part Number: CPF0402B10KE
R23 = RC0402FR-0722K1L: RES 22.1K OHM 1% 1/16W 0402; Manufacturer: Yageo; Power (Watts): 0.063W, 1/16W; Resistance: 22.1 kOhms; Temperature Coefficient: ±100ppm/°C; Part Number: RC0402FR-0722K1L; Value: 22K; ComponentLink1Description: Datasheet; ComponentLink1URL: https://www.yageo.com/upload/media/product/productsearch/datasheet/rchip/PYu-RC_Group_51_RoHS_L_10.pdf; ComponentLink2Description: DigiKey Link; ComponentLink2URL: https://www.digikey.com/en/products/detail/yageo/RC0402FR-0722K1L/726563; Composition: Thick Film; Device Package: 0402 (1005 Metric); Features: Moisture Resistant; Height - Seated (Max): 0.016" (0.40mm); LastUpdated: 23/01/2024 8:29:15 PM; Lifecycle Status: Active; Minimum Order: 1; Number of Terminations: 2; Operating Temperature: -55°C ~ 155°C; Package / Case: 0402 (1005 Metric); Packaging: CutTape; PartId: 2641; Part Status: Active; Price: 0.01; Series: RC_L; Size / Dimension: 0.039" L x 0.020" W (1.00mm x 0.50mm); Supplier 1: DigiKey; Supplier Part Number 1: 311-22.1KLRCT-ND; Supplier Device Package: 0402; Tolerance: ±1%
R24 = CMP-00030-39853526-1: WSR3R0200FEA Res Metal Strip 4527 0.02 Ohm 1% 3W ±75ppm/°C Molded SMD SMD Embossed Plastic T/R; Resistance: 20mΩ; Voltage Rating (DC): 240mV; Features: Automotive AEC-Q200, Moisture Resistant; Tolerance: 1%; Radiation Hardening: No; Composition: Metal Element; Width: 6.98mm; Min Operating Temperature: -65°C; Case Code (Imperial): 4527; Schedule B: 8533210045, 8533210045; Height: 2.41mm; Max Power Dissipation: 3W; Military Standard: Not; Contact Plating: Silver, Tin; Lead Free: Lead Free; Power Rating: 3W; Case/Package: 4527; RoHS: Compliant; REACH SVHC: No SVHC; Depth: 6.98mm; Number of Terminations: 2; Temperature Coefficient: 75ppm/°C; NexarPartId: 39853526; Packaging: Cut Tape; Length: 11.56mm; Termination: SMD/SMT; Max Operating Temperature: 275°C
R25 = RMCF0603JT1K80: RES 1.8K OHM 5% 1/10W 0603; Manufacturer: Stackpole Electronics Inc; Power (Watts): 0.1W, 1/10W; Resistance: 1.8 kOhms; Temperature Coefficient: ±200ppm/°C; Part Number: RMCF0603JT1K80; Value: 1K8; ComponentLink1Description: Datasheet; ComponentLink1URL: https://www.seielect.com/catalog/sei-rmcf_rmcp.pdf; ComponentLink2Description: DigiKey Link; ComponentLink2URL: https://www.digikey.com/en/products/detail/stackpole-electronics-inc/RMCF0603JT1K80/1758097; Composition: Thick Film; Device Package: 0603 (1608 Metric); Features: Automotive AEC-Q200; Height - Seated (Max): 0.022" (0.55mm); LastUpdated: 27/01/2024 8:36:44 PM; Lifecycle Status: Active; Minimum Order: 1; Number of Terminations: 2; Operating Temperature: -55°C ~ 155°C; Package / Case: 0603 (1608 Metric); Packaging: CutTape; PartId: 5907; Part Status: Active; Price: 0.01; Ratings: AEC-Q200; Series: RMCF; Size / Dimension: 0.061" L x 0.031" W (1.55mm x 0.80mm); Supplier 1: DigiKey; Supplier Part Number 1: RMCF0603JT1K80CT-ND; Supplier Device Package: 0603; Tolerance: ±5%
S1 = CMP-2000-05160-2: SWITCH TACTILE SPST-NO 0.05A 12V; Contact Resistance: 100mR; Throw Configuration: SPST; Illumination Type: Non-Illuminated; Mechanical Life: 100000Cycles; Current Rating: 50mA; Switch Function: Off-Mom; Actuator Length: 0.85mm; Actuator Material: Nylon; Actuator Type: Standard; Operating Force: 160gf; Min Operating Temperature: -20°C; REACH SVHC: No SVHC; Termination: Gull Wing; Case/Package: SMD/SMT; Packaging: Tape and Reel; Mount: Surface Mount; Voltage Rating (DC): 12V; Orientation: Straight; Lead Free: Lead Free; Contact Material: Silver; Color: Black; Max Current Rating: 50mA; Contact Plating: Silver; Depth: 9mm; Package Quantity: 1; Max Voltage Rating (DC): 12V; Length: 6mm; Max Operating Temperature: 60°C
S2 = CMP-10038-000025-1: SWITCH SLIDE SPDT 1MA 5V; Actuator Material: Nylon; Contact Resistance: 70mR; Electrical Life: 15000Cycles; Actuator Length: 1.5mm; Switch Function: On-On; Actuator Type: Standard; Actuator Color: Black; Current Rating: 1mA; Throw Configuration: SPDT; Termination: Gull Wing; Housing Material: Nylon; Max Operating Temperature: 85°C; Max Voltage Rating (DC): 5V; Voltage Rating (DC): 5V; Contact Plating: Silver; Radiation Hardening: No; Package Quantity: 1; REACH SVHC: No SVHC; RoHS Compliant: Yes; Orientation: Right Angle; Max Current Rating: 1mA; Case/Package: SMD/SMT; Contact Current Rating: 1mA; Contact Material: Copper Alloy; Mount: Surface Mount; Flammability Rating: UL94 V-2; Packaging: Tape and Reel; Switch Travel: 1.5mm; Length: 7.8mm; Series: JS; Min Operating Temperature: -20°C; Depth: 4.82mm
S3 S4 = 218-6LPST: SWITCH SLIDE DIP SPST 25MA 24V; Part Number: 218-6LPST
U1 = CMP-0243-00019-3: ARM Cortex-M4 32-bit MCU+FPU, 210 DMIPS, 1024 kB Flash, 192 kB Internal RAM, 51 I/Os, 64-pin LQFP, -40 to 85 degC, Tray; Manufacturer: STMicroelectronics; Supply Voltage(Vcc) min (V): 1.8; Supply Voltage(Vcc) max (V): 3.6; Internal RAM Size (kB): 192; I/Os (High Current): 51; D/A Converter: 2x12-bit; FLASH Size (Prog) (kB): 1024; Operating Frequency(F) (Processor speed) (MHz): 168; ComponentLink2Description: Datasheet; PackageVersion: Rev. 4, 06/2013; DatasheetVersion: Rev. 4; Core: ARM Cortex-M4; ComponentLink2URL: http://www.st.com/st-web-ui/static/active/en/resource/technical/document/datasheet/DM00037051.pdf; PackageReference: LQFP64; Packing: Tray; ComponentLink1Description: Manufacturer URL; ComponentLink3URL: http://www.st.com/st-web-ui/static/active/en/resource/technical/document/datasheet/DM00037051.pdf; ComponentLink3Description: Package Specification; Mounting Technology: Surface Mount; ComponentLink1URL: http://www.st.com/web/en/home.html; PackageDescription: 64-Pin Low Profile Quad Flat Package, 10 x 10 mm Body, 0.5 mm Pitch; PartNumber: STM32F405RGT6
U2 = CMP-2000-05026-1: Intelligent Control LED Integrated Light Source, 3.5 to 5.3 V, -25 to 80 degC, 4-Pin SMD, RoHS, Tape and Reel; Manufacturer: Adafruit-Industries-LLC; Number of LEDs: 10; Configuration: Discrete; Utilized LED: WS2812(5050); Datasheet URL: http://datasheet.octopart.com/ADA1655-Adafruit-Industries-datasheet-32028139.pdf; Series: Neopixel; Interface: -; Package Description: 4-Pin Surface Mount Device, Body 5 x 5 mm; Color: Red,Green,Blue(RGB); Category: Optoelectronics; Controller Type: -; Package Reference: 1655; Manufacturer URL: https://www.adafruit.com/; Mounting Type: SurfaceMount; Datasheet Version: May-13; Size / Dimension: 5.00mmLx5.00mmW; Family: Addressable,Specialty
U3 U4 = CMP-1595-00001-4: IC LED DRVR LIN DIM 25MA 28HVQFN; Number of Outputs: 16; Output Voltage: 5.5V; Frequency: 50MHz; Min Operating Temperature: -40°C; Package Quantity: 4000; Case/Package: VQFN; Number of Pins: 28; Contact Plating: Gold; Radiation Hardening: No; RoHS Compliant: Yes; Packaging: Tape and Reel; Mount: Surface Mount; Max Operating Temperature: 85°C
U5 = CMP-2000-06859-1: Single Chip Transceiver, 2.4 GHz, 60 mW, 1.9 to 3.6 V, -40 to 85 degC, 20-Pin QFN, RoHS, Tray; Manufacturer: Nordic Semiconductor; Data Rate (Max): 2Mbps; Current - Transmitting: 7mA~11.3mA; Power - Output: 0dBm; Other Names: 1490-1019; Online Catalog: nRF24L01+; Current - Receiving: 12.6mA~13.5mA; For Use With: 1490-1002-ND-KITEVALUATIONNRF24L01P1568-1295-ND-SPARKFUNTRANSCEIVERBREAKOUT-1568-1296-ND-SPARKFUNTRANSCEIVERBREAKOUT-1471-1410-ND-DEVBOARDNRFSCLICKNRF24L01P-MODULE-PCB-ND-KITEVALNRF24L01+PCBANTENNANRF24L01P-MODULE-SMA-ND-KITEVALNRF24L01+SMACONNNRF24L01P-UPGRADE-ND-UPGRADE2PCB/1SMANRF24L01103990038-ND-DEVDUINOSENSORNODEV1.3103990053-ND-DEVDUINOSENSORNODEV2(ATMEGA103990074-ND-DEVDUINOSENSORNODE106990026-ND-ENERGYMONITORSHIELDV2113990088-ND-WIRELESSGATESHIELD113990095-ND-DEVDUINOSENSORNODEV3(ATMEGA106030001-ND-ENERGYMONITORSHIELD1597-1361-ND-DEVDUINOSENSORNODEV2.2(ATMEG105990030-ND-RGBWSTRIPWIRELESSSHIELDV1.0; Frequency: 2.4GHz; Design Resources: DevelopmentToolSelector; RF Family/Standard: GeneralISM>1GHZ; Serial Interfaces: SPI; Sensitivity: -94dBm; Voltage - Supply: 1.9V~3.6V; Modulation: GFSK; GPIO: -; Package Reference: QFN20; Memory Size: -; Category: RF/IFandRFID; Type: TxRxOnly; Standard Package: 490; Package / Case: 20-VFQFNExposedPad; Packaging: Tray; Series: -; Package Description: 20-Pin Quad Flat No-lead Package, Body 4 x 4 mm, Pitch 0.5 mm; Datasheet Version: Rev. 1.0, 09/2008; Protocol: -; Manufacturer URL: http://www.nordicsemi.com/eng/Products/; Operating Temperature: -40°C~85°C; Family: RFTransceiverICs; Datasheet URL: http://www.nordicsemi.com/eng/content/download/2726/34069/file/nRF24L01P_Product_Specification_1_0.pdf; Mounting Technology: SurfaceMount
U6 = HPP845E031R4: SENSOR HUMID/TEMP 3V I2C 2% SMD; Part Number: HPP845E031R4
U7 = CMP-0482-00795-1: Wide Range I2C Power Monitor, 12-pin SOP (MS-12), 0 to 70 degC, Pb-Free; Manufacturer: Linear Technology; Number of Supplies(#): 1; ComponentLink3Description: Package Specification; PackageDescription: 12-Pin Plastic MSOP, Body 4.039 x 3 mm, Pitch 0.65 mm; RoHS: TRUE; ComponentLink1URL: http://www.linear.com/; ComponentLink2Description: Datasheet; PackageVersion: Rev. A, 05/2013; PackageReference: MS-12; ComponentLink3URL: http://cds.linear.com/docs/en/packaging/05081668_A_MS12.pdf; PartNumber: LTC2945CMS#PBF; ComponentLink1Description: Manufacturer URL; ComponentLink2URL: http://cds.linear.com/docs/en/datasheet/2945f.pdf; Mounting Technology: Surface Mount
U8 = CMP-1753-00002-2: 3-Axis Gyroscope, Accelerometer and a Digital Motion Processor(TM) (DMP), 2.375 to 3.46 V, -40 to 85 degC, 24-Pin QFN, RoHS, Tape and Reel; Manufacturer: InvenSense; Featured Product: MPU-60506-Axis,IntegratedI²CSolution; Other Names: 1428-1007-2 / MPU6050; Sensor Type: MotionTracking; Online Catalog: MPU-6000™Series; Unit PriceUSD: Digital; Datasheet Version: Rev. 3.3, 05/2012; Category: Sensors,Transducers; Datasheet URL: http://datasheet.octopart.com/MPU-6050-InvenSense-datasheet-14421344.pdf; Family: Multifunction; Standard Package: 5,000; Manufacturer URL: http://www.invensense.com/; Output Type: Digital; Dynamic Catalog: MPU-6000™Series
U9 = CMP-209535-000001-1: LDO Voltage Regulators 1A, 3.3V; Manufacturer: Advanced Monolithic Systems; Dropout Voltage: 1.1V; Output Type: Fixed; Nominal Supply Current: 5mA; Max Power Dissipation: 1.2W; Max Supply Voltage: 15V; Number Of Outputs: 1; Standoff Height: 0.64mm; Max Junction Temp: +125°C; Height: 1.8mm; Package: AMS1117; Device Class L2: Power Management ICs; ComponentLink2Description: Datasheet; ComponentLink2URL: http://www.advanced-monolithic.com/pdf/ds1117.pdf; Category: IC; RoHS: TRUE; Automotive: No; Device Class L1: Integrated Circuits (ICs); Output Current: 1A; Device Class L3: Voltage Regulators - Linear; Temperature: -40°C to +125°C; Output Voltage: 3.3V; Manufacturer Part Number: AMS1117-3.3; Temperature Range Low: -40°C; Octopart: https://octopart.com/ams1117-3.3-advanced+monolithic+systems-25899300; Lead Free: Yes; Ipc Land Pattern Name: SOT229P700X180-4; Temperature Range High: +125°C
U10 = USBLC6-2SC6: 17V Clamp 5A (8/20Âµs) Ipp Tvs Diode Surface Mount SOT-23-6; MF: STMicroelectronics; Value: *; SnapEDA_Link: https://www.snapeda.com/parts/USBLC6-2SC6/STMicroelectronics/view-part/?ref=snap; Check_prices: https://www.snapeda.com/parts/USBLC6-2SC6/STMicroelectronics/view-part/?ref=eda; Purchase-URL: https://pricing.snapeda.com/search/part/USBLC6-2SC6/?ref=eda; Price: None; Availability: In Stock; Package: SOT-23-6 STMicroelectronics; MP: USBLC6-2SC6
Y1 Y2 = CMP-03913-116855757-1: 830108207109 WE-XTAL Quartz Crystal; Frequency: 16MHz; Width: 2.5mm; Max Operating Temperature: 85°C; Height: 800µm; NexarPartId: 116855757; Min Operating Temperature: -40°C; Length: 3.2mm